# EAGLE schematic RobotTraceStopWatch (EAGLE 7.7.0)
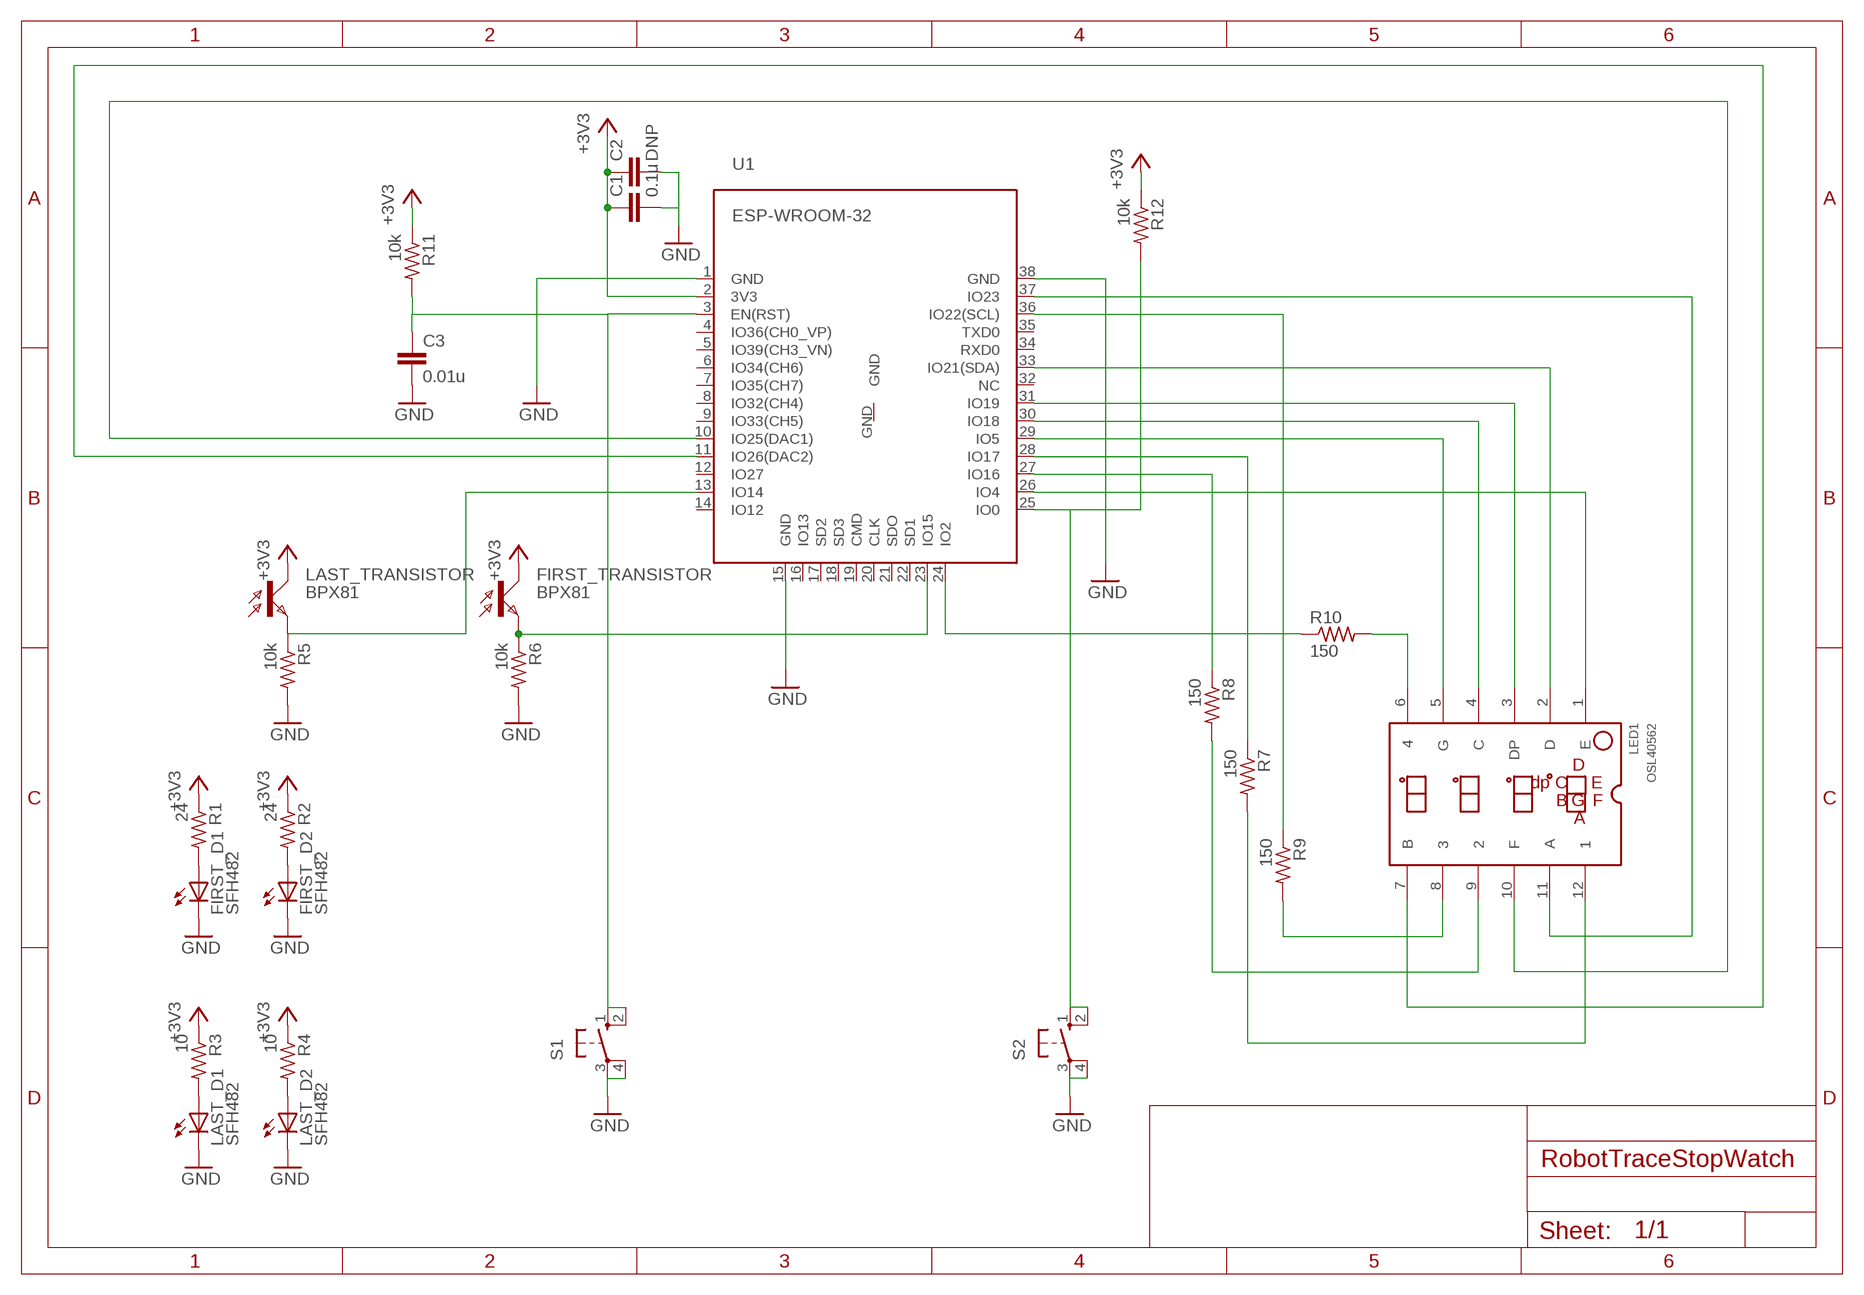
[diagram p0: schematic, sheet 1]

## Parts
C1  0.1u  C  [C0805]
C2  DNP  C  [C0805]
C3  0.01u  C  [C0805]
FIRST_D1  SFH482  [SFH482]
FIRST_D2  SFH482  [SFH482]
FIRST_TRANSISTOR  BPX81  [BPX81]
LAST_D1  SFH482  [SFH482]
LAST_D2  SFH482  [SFH482]
LAST_TRANSISTOR  BPX81  [BPX81]
LED1  OSL40562  [OSL40562]
R1  24  R-US_0204/7  [0204/7]
R2  24  R-US_0204/7  [0204/7]
R3  10  R-US_0204/7  [0204/7]
R4  10  R-US_0204/7  [0204/7]
R5  10k  R-US_0204/7  [0204/7]
R6  10k  R-US_0204/7  [0204/7]
R7  150  R-US_0204/7  [0204/7]
R8  150  R-US_0204/7  [0204/7]
R9  150  R-US_0204/7  [0204/7]
R10  150  R-US_0204/7  [0204/7]
R11  10k  R-US_0204/7  [0204/7]
R12  10k  R-US_0204/7  [0204/7]
S1  10-XX  [B3F-10XX]
S2  10-XX  [B3F-10XX]
U1  ESP-WROOM-32  [ESP-WROOM-32]

## Nets
+3V3: C1.1 C2.1 FIRST_TRANSISTOR.C LAST_TRANSISTOR.C R1.1 R2.1 R3.1 R4.1 R11.1 R12.1 U1.2(3V3)
GND: C1.2 C2.2 C3.2 FIRST_D1.K(C) FIRST_D2.K(C) LAST_D1.K(C) LAST_D2.K(C) R5.2 R6.2 S1.3(P) S1.4(P1) S2.3(P) S2.4(P1) U1.1(GND) U1.15(GND) U1.38(GND)
N$1: FIRST_D1.A R1.2
N$2: FIRST_D2.A R2.2
N$3: LAST_D1.A R3.2
N$4: LAST_D2.A R4.2
N$5: LAST_TRANSISTOR.E R5.1 U1.13(IO14)
N$6: FIRST_TRANSISTOR.E R6.1 U1.23(IO15)
N$7: R10.1 U1.24(IO2)
N$8: R9.1 U1.36(IO22(SCL))
N$9: R8.1 U1.27(IO16)
N$10: R7.1 U1.28(IO17)
N$11: LED1.5(G) U1.29(IO5)
N$12: LED1.4(C) U1.30(IO18)
N$13: LED1.3(DP) U1.31(IO19)
N$14: LED1.2(D) U1.33(IO21(SDA))
N$15: LED1.1(E) U1.26(IO4)
N$16: LED1.6 R10.2
N$17: LED1.12 R7.2
N$18: LED1.9 R8.2
N$19: LED1.8 R9.2
N$20: LED1.11(A) U1.37(IO23)
N$21: R12.2 S2.1(S) S2.2(S1) U1.25(IO0)
N$22: LED1.10(F) U1.10(IO25(DAC1))
N$23: LED1.7(B) U1.11(IO26(DAC2))
N$24: C3.1 R11.2 S1.1(S) S1.2(S1) U1.3(EN(RST))
Unconnected: U1.4(IO36(CH0_VP)) U1.5(IO39(CH3_VN)) U1.6(IO34(CH6)) U1.7(IO35(CH7)) U1.8(IO32(CH4)) U1.9(IO33(CH5)) U1.12(IO27) U1.14(IO12) U1.16(IO13) U1.17(SD2) U1.18(SD3) U1.19(CMD) U1.20(CLK) U1.21(SDO) U1.22(SD1) U1.32(NC) U1.34(RXD0) U1.35(TXD0) U1.GND

## Library data of the parts
C1-C3 = 0my_lbr:C: CAPACITOR, European symbol; SPICEMODEL: NONE; SPICEPREFIX: C
FIRST_D1 FIRST_D2 LAST_D1 LAST_D2 = led:SFH482: IR LED infrared emitting diode, Infineon
FIRST_TRANSISTOR LAST_TRANSISTOR = opto-trans-siemens:BPX81: PHOTO TRANSISTOR; OC_FARNELL: unknown; OC_NEWARK: unknown
LED1 = OSL40562:OSL40562
R1-R12 = 0my_lbr:R-US_: RESISTOR, American symbol
S1 S2 = 0my_lbr:10-XX: OMRON SWITCH; MPN: B3F-1000; OC_FARNELL: 176432; OC_NEWARK: 36M3542
U1 = 0my_lbr:ESP-WROOM-32